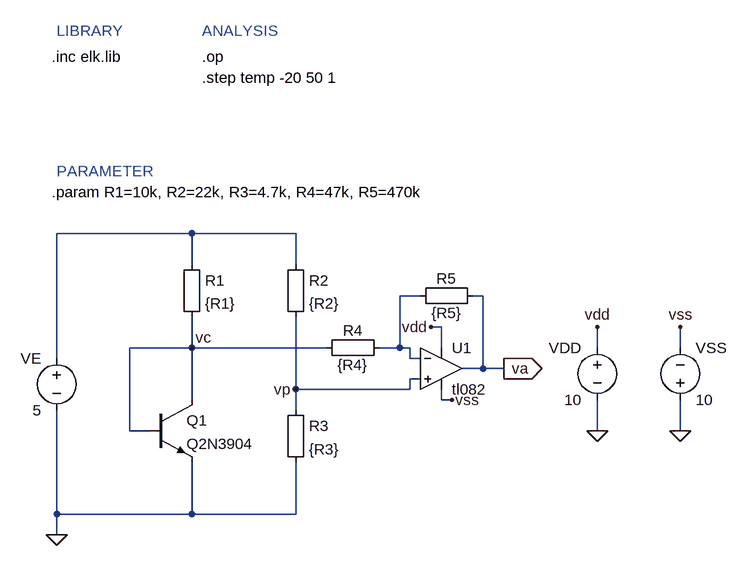
[diagram p0: schematic Transistor-Thermometer.asc]
Transistor-Thermometer.asc, the LTspice schematic file:
Version 4
SHEET 1 948 680
WIRE 96 -400 -112 -400
WIRE 256 -400 96 -400
WIRE 96 -352 96 -400
WIRE 256 -352 256 -400
WIRE 448 -304 416 -304
WIRE 544 -304 528 -304
WIRE 480 -256 464 -256
WIRE 96 -224 96 -272
WIRE 96 -224 0 -224
WIRE 304 -224 96 -224
WIRE 416 -224 416 -304
WIRE 416 -224 384 -224
WIRE 432 -224 416 -224
WIRE 480 -224 480 -256
WIRE 720 -224 720 -256
WIRE 848 -224 848 -256
WIRE -112 -208 -112 -400
WIRE 432 -208 432 -224
WIRE 448 -208 432 -208
WIRE 544 -192 544 -304
WIRE 544 -192 512 -192
WIRE 576 -192 544 -192
WIRE 448 -176 432 -176
WIRE 256 -160 256 -272
WIRE 432 -160 432 -176
WIRE 432 -160 256 -160
WIRE 96 -144 96 -224
WIRE 480 -144 480 -160
WIRE 496 -144 480 -144
WIRE 256 -128 256 -160
WIRE 0 -96 0 -224
WIRE 32 -96 0 -96
WIRE 720 -96 720 -144
WIRE 848 -96 848 -144
WIRE -112 32 -112 -128
WIRE 96 32 96 -48
WIRE 96 32 -112 32
WIRE 256 32 256 -48
WIRE 256 32 96 32
WIRE -112 64 -112 32
FLAG -112 64 0
FLAG 720 -96 0
FLAG 848 -96 0
FLAG 720 -256 vdd
FLAG 848 -256 vss
FLAG 464 -256 vdd
FLAG 496 -144 vss
FLAG 576 -192 va
IOPIN 576 -192 Out
FLAG 96 -224 vc
FLAG 256 -160 vp
SYMBOL voltage -112 -224 M0
WINDOW 123 0 0 Left 0
WINDOW 39 0 0 Left 0
SYMATTR InstName VE
SYMATTR Value 5
SYMBOL voltage 720 -240 M0
SYMATTR InstName VDD
SYMATTR Value 10
SYMBOL voltage 848 -128 M180
WINDOW 0 24 96 Left 2
WINDOW 3 24 16 Left 2
SYMATTR InstName VSS
SYMATTR Value 10
SYMBOL opamp2 480 -256 R0
SYMATTR InstName U1
SYMATTR Value tl082
SYMBOL npn 32 -144 R0
SYMATTR InstName Q1
SYMATTR Value Q2N3904
SYMBOL Misc\\EuropeanResistor 80 -368 R0
SYMATTR InstName R1
SYMATTR Value {R1}
SYMBOL Misc\\EuropeanResistor 240 -368 R0
SYMATTR InstName R2
SYMATTR Value {R2}
SYMBOL Misc\\EuropeanResistor 240 -144 R0
SYMATTR InstName R3
SYMATTR Value {R3}
SYMBOL Misc\\EuropeanResistor 400 -240 R90
WINDOW 0 5 56 VBottom 2
WINDOW 3 27 56 VTop 2
SYMATTR InstName R4
SYMATTR Value {R4}
SYMBOL Misc\\EuropeanResistor 544 -320 R90
WINDOW 0 5 56 VBottom 2
WINDOW 3 27 56 VTop 2
SYMATTR InstName R5
SYMATTR Value {R5}
TEXT -120 -672 Left 2 !.inc elk.lib
TEXT -120 -464 Left 2 !.param R1=10k, R2=22k, R3=4.7k, R4=47k, R5=470k
TEXT 112 -712 Left 2 ;ANALYSIS
TEXT -112 -712 Left 2 ;LIBRARY
TEXT -112 -496 Left 2 ;PARAMETER
TEXT 112 -640 Left 2 !.step temp -20 50 1
TEXT 112 -672 Left 2 !.op

The netlist it stands for:
* Transistor-Thermometer.asc
VE N001 0 5
VDD vdd 0 10
VSS 0 vss 10
XU1 vp N002 vdd vss va tl082  ; pins In+ In- V+ V- OUT
Q1 vc vc 0 0 Q2N3904
R1 N001 vc {R1}
R2 N001 vp {R2}
R3 vp 0 {R3}
R4 N002 vc {R4}
R5 va N002 {R5}
.model NPN NPN
.model PNP PNP
.lib standard.bjt
.inc elk.lib
.param R1=10k, R2=22k, R3=4.7k, R4=47k, R5=470k
* ANALYSIS
* LIBRARY
* PARAMETER
.step temp -20 50 1
.op
.backanno
.end